# Altium schematic sheet Sheet1.SchDoc
size 431 x 228 mm; SheetNumber: 1; SheetTotal: 1
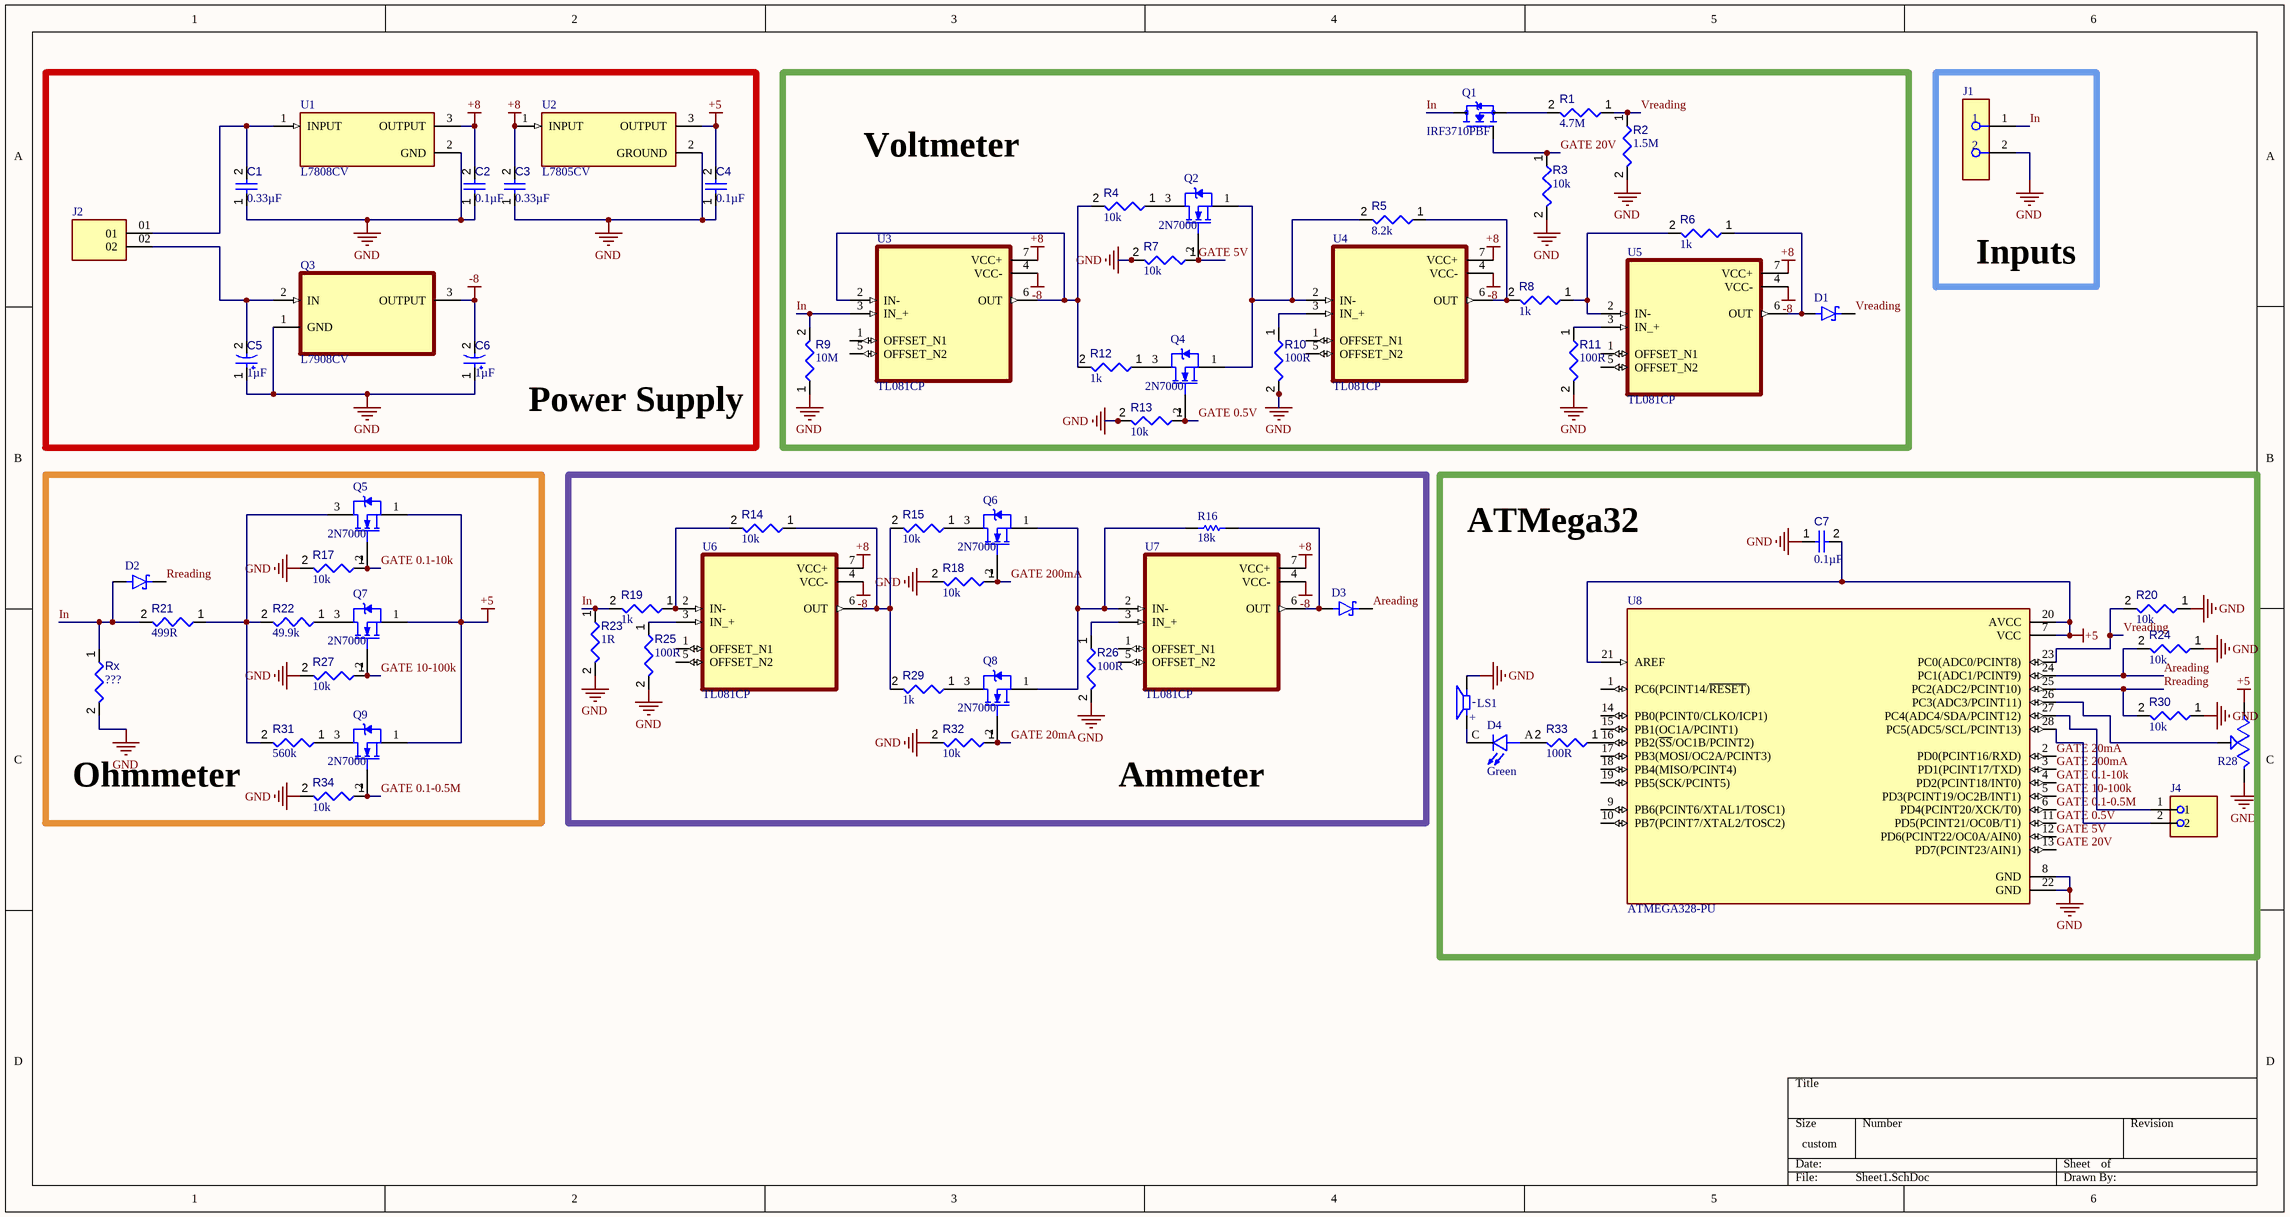
[diagram p0: Sheet1.SchDoc]

## Parts
C1  value 0.33µF  [CAPC2013X135X45NL10T25]  (hidden comment: Capacitor 1 uF +/- 10% 50 V 0805)
C2  value 0.1µF  [CAPC2013X135X45NL10T25]  (hidden comment: Capacitor 1 uF +/- 10% 50 V 0805)
C3  value 0.33µF  [CAPC2013X135X45NL10T25]  (hidden comment: Capacitor 1 uF +/- 10% 50 V 0805)
C4  value 0.1µF  [CAPC2013X135X45NL10T25]  (hidden comment: Capacitor 1 uF +/- 10% 50 V 0805)
C5  value 1µF  [CAPPR65-350-1150X800X1250]  (hidden comment: ECA-2AM470)
C6  value 1µF  [CAPPR65-350-1150X800X1250]  (hidden comment: ECA-2AM470)
C7  value 0.1µF  [CAPC2013X135X45NL10T25]  (hidden comment: Capacitor 1 uF +/- 10% 50 V 0805)
D1  1N4733A  [DIOAD1036W78L463D272]  (value not drawn)
D2  1N4733A  [DIOAD1036W78L463D272]  (value not drawn)
D3  1N4733A  [DIOAD1036W78L463D272]  (value not drawn)
D4  Green  [LEDRD254W50D500H1060]
J1  CMP-73906-000010-1_1  [FP-2269-2-MFG]  (value not drawn)
J2  SSW-102-01-X-S  [SAMTEC_SSW-102-01-X-S]  (value not drawn)
J4  1713723  [PHOENIX_1713723]  (value not drawn)
LS1  PKM17EPP-2002-B0  [SPKR_PKM17EPP-2002-B0]  (value not drawn)
Q1  IRF3710PBF  [TO254P1016X419X2057-3]
Q2  2N7000  [ONSC-TO-92-3-29-11_AM_BL]
Q3  L7908CV  [TO254P450X1020X1935-3P]
Q4  2N7000  [ONSC-TO-92-3-29-11_AM_BL]
Q5  2N7000  [ONSC-TO-92-3-29-11_AM_BL]
Q6  2N7000  [ONSC-TO-92-3-29-11_AM_BL]
Q7  2N7000  [ONSC-TO-92-3-29-11_AM_BL]
Q8  2N7000  [ONSC-TO-92-3-29-11_AM_BL]
Q9  2N7000  [ONSC-TO-92-3-29-11_AM_BL]
R1  value 4.7M  [RESC0805(2012)_L]  (hidden comment: 1KR5J)
R2  value 1.5M  [RESC0805(2012)_L]  (hidden comment: 1KR5J)
R3  value 10k  [RESC0805(2012)_L]  (hidden comment: 1KR5J)
R4  value 10k  [RESC0805(2012)_L]  (hidden comment: 1KR5J)
R5  value 8.2k  [RESC0805(2012)_L]  (hidden comment: 1KR5J)
R6  value 1k  [RESC0805(2012)_L]  (hidden comment: 1KR5J)
R7  value 10k  [RESC0805(2012)_L]  (hidden comment: 1KR5J)
R8  value 1k  [RESC0805(2012)_L]  (hidden comment: 1KR5J)
R9  value 10M  [RESC0805(2012)_L]  (hidden comment: 1KR5J)
R10  value 100R  [RESC0805(2012)_L]  (hidden comment: 1KR5J)
R11  value 100R  [RESC0805(2012)_L]  (hidden comment: 1KR5J)
R12  value 1k  [RESC0805(2012)_L]  (hidden comment: 1KR5J)
R13  value 10k  [RESC0805(2012)_L]  (hidden comment: 1KR5J)
R14  value 10k  [RESC0805(2012)_L]  (hidden comment: 1KR5J)
R15  value 10k  [RESC0805(2012)_L]  (hidden comment: 1KR5J)
R16  value 18k  [RESC3116X70X50ML13T20]  (hidden comment: Resistor 1k +/-1% 1206 250 mW)
R17  value 10k  [RESC0805(2012)_L]  (hidden comment: 1KR5J)
R18  value 10k  [RESC0805(2012)_L]  (hidden comment: 1KR5J)
R19  value 1k  [RESC0805(2012)_L]  (hidden comment: 1KR5J)
R20  value 10k  [RESC0805(2012)_L]  (hidden comment: 1KR5J)
R21  value 499R  [RESC0805(2012)_L]  (hidden comment: 1KR5J)
R22  value 49.9k  [RESC0805(2012)_L]  (hidden comment: 1KR5J)
R23  value 1R  [RESC0805(2012)_L]  (hidden comment: 1KR5J)
R24  value 10k  [RESC0805(2012)_L]  (hidden comment: 1KR5J)
R25  value 100R  [RESC0805(2012)_L]  (hidden comment: 1KR5J)
R26  value 100R  [RESC0805(2012)_L]  (hidden comment: 1KR5J)
R27  value 10k  [RESC0805(2012)_L]  (hidden comment: 1KR5J)
R28  PTN16-A10220K1B1  [POT_PTN16-A10220K1B1]  (value not drawn)
R29  value 1k  [RESC0805(2012)_L]  (hidden comment: 1KR5J)
R30  value 10k  [RESC0805(2012)_L]  (hidden comment: 1KR5J)
R31  value 560k  [RESC0805(2012)_L]  (hidden comment: 1KR5J)
R32  value 10k  [RESC0805(2012)_L]  (hidden comment: 1KR5J)
R33  value 100R  [RESC0805(2012)_L]  (hidden comment: 1KR5J)
R34  value 10k  [RESC0805(2012)_L]  (hidden comment: 1KR5J)
Rx  value ???  [RESC0805(2012)_L]  (hidden comment: 1KR5J)
U1  L7808CV  [TO255P1020X450X1968-3B]
U2  L7805CV  [TO255P1040X460X1968-3]
U3  TL081CP  [DIP794W45P254L959H508Q8]
U4  TL081CP  [DIP794W45P254L959H508Q8]
U5  TL081CP  [DIP794W45P254L959H508Q8]
U6  TL081CP  [DIP794W45P254L959H508Q8]
U7  TL081CP  [DIP794W45P254L959H508Q8]
U8  ATMEGA328-PU  [DIP787W46P254L3467H508Q28]

## Blocks framed on the sheet
Power Supply: C1-C6 J2 Q3 U1 U2
Voltmeter: D1 Q1 Q2 Q4 R1-R13 U3-U5
Inputs: J1
Ohmmeter: D2 Q5 Q7 Q9 R17 R21 R22 R27 R31 R34 Rx
Ammeter: D3 Q6 Q8 R14-R16 R18 R19 R23 R25 R26 R29 R32 U6 U7
ATMega32: C7 D4 J4 LS1 R20 R24 R28 R30 R33 U8

## Nets
+5: C4.2 C7.2 Q5.1(S) Q7.1(S) Q9.1(S) R28.1 U2.3(OUTPUT) U8.7(VCC) U8.20(AVCC) U8.21(AREF)
+8: C2.2 C3.2 U1.3(OUTPUT) U2.1(INPUT) U3.7(VCC+) U4.7(VCC+) U5.7(VCC+) U6.7(VCC+) U7.7(VCC+)
-8: C6.2 Q3.3(OUTPUT) U3.4(VCC-) U4.4(VCC-) U5.4(VCC-) U6.4(VCC-) U7.4(VCC-)
GND: C1.1 C2.1 C3.1 C4.1 C5.1 C6.1 C7.1 J1.2 LS1.N Q3.1(GND) R2.2 R3.2 R7.2 R9.1 R10.2 R11.2 R13.2 R17.2 R18.2 R20.1 R23.2 R24.1 R25.2 R26.2 R27.2 R28.3 R30.1 R32.2 R34.2 Rx.2 U1.2(GND) U2.2(GROUND) U8.8(GND) U8.22(GND)
Areading: D3.1(K) R24.2 U8.24(PC1(ADC1/PCINT9))
GATE 0.1-0.5M: Q9.2(G) R34.1 U8.6(PD4(PCINT20/XCK/T0))
GATE 0.1-10k: Q5.2(G) R17.1 U8.4(PD2(PCINT18/INT0))
GATE 0.5V: Q4.2(G) R13.1 U8.11(PD5(PCINT21/OC0B/T1))
GATE 5V: Q2.2(G) R7.1 U8.12(PD6(PCINT22/OC0A/AIN0))
GATE 10-100k: Q7.2(G) R27.1 U8.5(PD3(PCINT19/OC2B/INT1))
GATE 20mA: Q8.2(G) R32.1 U8.2(PD0(PCINT16/RXD))
GATE 20V: Q1.1(G) R3.1 U8.13(PD7(PCINT23/AIN1))
GATE 200mA: Q6.2(G) R18.1 U8.3(PD1(PCINT17/TXD))
In: D2.2(A) J1.1 Q1.2(D) R9.2 R19.2 R21.2 R23.1 Rx.1 U3.3(IN_+)
Rreading: D2.1(K) R30.2 U8.25(PC2(ADC2/PCINT10))
Vreading: D1.1(K) R1.1 R2.1 R20.2 U8.23(PC0(ADC0/PCINT8))
NetC1_2: C1.2 J2.01 U1.1(INPUT)
NetC5_2: C5.2 J2.02 Q3.2(IN)
NetD1_2: D1.2(A) R6.1 U5.6(OUT)
NetD3_2: D3.2(A) R16.1 U7.6(OUT)
NetD4_A: D4.A R33.2
NetD4_C: D4.C LS1.P
NetJ4_1: J4.1 U8.27(PC4(ADC4/SDA/PCINT12))
NetJ4_2: J4.2 U8.28(PC5(ADC5/SCL/PCINT13))
NetQ1_3: Q1.3(S) R1.2
NetQ2_1: Q2.1(S) Q4.1(S) R5.2 U4.2(IN-)
NetQ2_3: Q2.3(D) R4.1
NetQ4_3: Q4.3(D) R12.1
NetQ5_3: Q5.3(D) R21.1 R22.2 R31.2
NetQ6_1: Q6.1(S) Q8.1(S) R16.2 U7.2(IN-)
NetQ6_3: Q6.3(D) R15.1
NetQ7_3: Q7.3(D) R22.1
NetQ8_3: Q8.3(D) R29.1
NetQ9_3: Q9.3(D) R31.1
NetR4_2: R4.2 R12.2 U3.2(IN-) U3.6(OUT)
NetR5_1: R5.1 R8.2 U4.6(OUT)
NetR6_2: R6.2 R8.1 U5.2(IN-)
NetR10_1: R10.1 U4.3(IN_+)
NetR11_1: R11.1 U5.3(IN_+)
NetR14_1: R14.1 R15.2 R29.2 U6.6(OUT)
NetR14_2: R14.2 R19.1 U6.2(IN-)
NetR25_1: R25.1 U6.3(IN_+)
NetR26_1: R26.1 U7.3(IN_+)
NetR28_2: R28.2 U8.26(PC3(ADC3/PCINT11))
NetR33_1: R33.1 U8.16(PB2(~{SS}/OC1B/PCINT2))

Not connected (* = marked no-connect by the designer): U3 1(OFFSET_N1) 5(OFFSET_N2); U4 1(OFFSET_N1) 5(OFFSET_N2); U5 1(OFFSET_N1) 5(OFFSET_N2); U6 1(OFFSET_N1) 5(OFFSET_N2); U7 1(OFFSET_N1) 5(OFFSET_N2); U8 1(PC6(PCINT14/~{RESET})) 9(PB6(PCINT6/XTAL1/TOSC1)) 10(PB7(PCINT7/XTAL2/TOSC2)) 14(PB0(PCINT0/CLKO/ICP1)) 15(PB1(OC1A/PCINT1)) 17(PB3(MOSI/OC2A/PCINT3)) 18(PB4(MISO/PCINT4)) 19(PB5(SCK/PCINT5))

## Notes on the sheet
- (in symbol PKM17EPP-2002-B0) -; +

## Library data of the parts
C1-C4 C7 = CMP-001-00007-6: Chip Capacitor, 1 uF, +/- 10%, 50 V, 0805 (2012 Metric); Capacitor Type: Ceramic; Voltage Rating: 50V; Min Operating Temperature: -55°C; RoHS Compliant: True; Mounting Technology: SM; Case/Package: 0805; Max Operating Temperature: 125°C; Tolerance: 10%; Pins: 2
C5 C6 = CMP-001-00036-7: Aluminum Electrolytic Capacitor, 47 uF, +/- 20%, 100 V, -40 to 85 degC, 2-Pin THD, RoHS, Bulk; Manufacturer: Panasonic; Ripple Current: 180mA; Voltage Rating: 100V; Max Operating Temperature: 85°C; Pins: 2; Case/Package: Radial; Packaging: Bulk; Capacitor Type: Electrolytic; Diameter: 8mm; RoHS Compliant: True; Package Reference: CAPPR65-350-1150X800X1250; Min Operating Temperature: -40°C; Mounting Technology: TH; Ripple Current (AC): 180mA; Datasheet Version: Mar-16; Lead Pitch: 3.5mm; Package Quantity: 200; Datasheet URL: http://industrial.panasonic.com/cdbs/www-data/pdf/RDF0000/ABA0000C1047.pdf; Package Description: 2-Pin Radial Lead, Dia 8 mm, Height 12.5 mm; Tolerance: 20%; Manufacturer URL: http://www.panasonic.com/
D1-D3 = 1N4733A: Zener Diode 5.1 V 1 W Â±5% Through Hole DO-41; MF: onsemi; SnapEDA_Link: https://www.snapeda.com/parts/1N4733A/Onsemi/view-part/?ref=snap; Package: DO-41 ON Semiconductor; Value: *; MP: 1N4733A; Check_prices: https://www.snapeda.com/parts/1N4733A/Onsemi/view-part/?ref=eda
D4 = L-53GD: LED 5mm Green 568nm 20mcd/10mA 60Â°; MF: Kingbright; Value: *; Package: CDIP-28; Check_prices: https://www.snapeda.com/parts/L-53GD/Kingbright/view-part/?ref=eda; MP: L-53GD; Price: None; SnapEDA_Link: https://www.snapeda.com/parts/L-53GD/Kingbright/view-part/?ref=snap; Availability: Unavailable
J1 = CMP-002-00255-1: CONN DBL BANANA JACK TURRET; Gender: Female; Max Current Rating: 15A; Body Material: PC; Number of Ports: 2; Voltage Rating (DC): 70V; Insulation: Mating End Insulated; Voltage Rating: 2.5kV; Contact Plating: Tin; Package Quantity: 5; Height: 0.375inch; Weight: 0.033lb; Width: 4inch; Insulation Material: Polycarbonate; Orientation: Straight; Housing Color: Red; Termination: Solder; RoHS Compliant: Yes; Lead Free: Lead Free; Length: 24inch; Mount: Panel; Color: Red; Contact Material: Brass; Source: Schlib2.SchLib; Housing Material: Polycarbonate; Current Rating: 15A; REACH SVHC: No SVHC; Packaging: Bulk; Design Item ID: CMP-73906-000010-1_1; Depth: 16mm; Number Of Contacts: 2
J2 = SSW-102-01-X-S: 2 Position Receptacle Connector Through Hole; MP: SSW-102-01-G-S; MF: Samtec; Purchase-URL: https://pricing.snapeda.com/search/part/SSW-102-01-G-S/?ref=eda; Price: None; SnapEDA_Link: https://www.snapeda.com/parts/SSW-102-01-G-S/Samtec/view-part/4872079/?ref=snap; Check_prices: https://www.snapeda.com/parts/SSW-102-01-G-S/Samtec/view-part/4872079/?ref=eda; Package: None; Availability: Good; Value: *
J4 = 1713723: MF: {'manufacturer': u'Phoenix Contact'}; Package: None; Price: None; Value: *; MP: 1713723; Availability: Unavailable
LS1 = PKM17EPP-2002-B0: Buzzers Transducer, Externally Driven Piezo 3V 2kHz 70dB @ 3V, 10cm Through Hole PC Pins; Package: None; Price: None; Value: *; MP: PKM17EPP-2002-B0; Availability: Unavailable
Q1 = IRF3710PBF: MOSFET, Power,N-Ch,VDSS 100V,RDS(ON) 18 Milliohms,ID 7.3A,SO-8,PD 2.5W,VGS+/-20V | Infineon IRF3710PBF; MF: Infineon Technologies; SnapEDA_Link: https://www.snapeda.com/parts/IRF3710PBF/Infineon+Technologies/view-part/?ref=snap; Package: TO-220-3 Infineon; Value: *; MP: IRF3710PBF; Check_prices: https://www.snapeda.com/parts/IRF3710PBF/Infineon+Technologies/view-part/?ref=eda
Q2 Q4-Q9 = CMP-013-00020-4: Small Signal MOSFET, 200 mA, 60 V, N-Channel, 3-Pin TO-92, Bulk Box; Manufacturer: Fairchild Semiconductor; Input Capacitance: 50pF; Power: 400mW; Rds On Max: 5Ohm; Nominal Dual Supply Voltage: 60V; Elements: 1; Package Version: Rev. AM; Nominal Vgs: 2.1V; RoHS Compliant: True; Mounting Technology: TH; Max Operating Temperature: 150°C; Package Quantity: 2000; Package Reference: TO-92-3-29-11_AM_BL; Datasheet Version: Rev. 8, 04/2011; Package Description: 3-Pin Transistor Outline, Body 4.825 x 3.685 mm, Pitch 1.27 mm; Packaging: Bulk; Min Operating Temperature: -55°C; Case/Package: TO-92; Datasheet URL: http://www.onsemi.com/pub_link/Collateral/2N7000-D.PDF; Pins: 3
Q3 = L7908CV: Linear Voltage Regulator IC Negative Fixed 1 Output  1.5A TO-220; MF: STMicroelectronics; SnapEDA_Link: https://www.snapeda.com/parts/L7908CV/STMicroelectronics/view-part/?ref=snap; Package: TO-220-3 STMicroelectronics; Value: *; MP: L7908CV; Check_prices: https://www.snapeda.com/parts/L7908CV/STMicroelectronics/view-part/?ref=eda
R1-R15 R17-R27 R29-R34 Rx = CMP-009-00076-2: 1K 0.125W 5% 0805 (2012 Metric)  SMD; Power: 125mW; Pins: 2; Mounting Technology: SMT; Tolerance: 5%; Case/Package: 0805
R16 = CMP-009-00011-5: Chip Resistor, 1 KOhm, +/- 1%, 0.25 W, -55 to 155 degC, 1206 (3216 Metric); Voltage Rating: 200V; Power: 250mW; Max Operating Temperature: 155°C; Mounting Technology: SM; Tolerance: 1%; Case/Package: 1206; RoHS Compliant: True; Min Operating Temperature: -55°C; Pins: 2
R28 = PTN16-A10220K1B1: MF: {'manufacturer': u'CUI Devices'}; Package: None; Price: None; Value: *; MP: PTN16-A10220K1B1; Availability: Unavailable
U1 = L7808CV: Linear Voltage Regulator IC Positive Fixed 1 Output 1.5A TO-220; MF: STMicroelectronics; SnapEDA_Link: https://www.snapeda.com/parts/L7808CV/STMicroelectronics/view-part/?ref=snap; Package: TO-220-3 STMicroelectronics; Value: *; MP: L7808CV; Check_prices: https://www.snapeda.com/parts/L7808CV/STMicroelectronics/view-part/?ref=eda
U2 = L7805CV: Linear Voltage Regulator IC Positive Fixed 1 Output 1.5A TO-220; MF: STMicroelectronics; SnapEDA_Link: https://www.snapeda.com/parts/L7805CV/STMicroelectronics/view-part/?ref=snap; Package: TO-220-3 ON Semiconductor; MP: L7805CV; Check_prices: https://www.snapeda.com/parts/L7805CV/STMicroelectronics/view-part/?ref=eda; Purchase-URL: https://pricing.snapeda.com/search/part/L7805CV/?ref=eda; Price: None; Value: *; Availability: In Stock
U3-U7 = TL081CP: Single, 30-V, 3-MHz, 13-V/Âµs slew rate, In to V+, JFET-input op amp; MF: Texas Instruments; Availability: In Stock; SnapEDA_Link: https://www.snapeda.com/parts/TL081CP/Texas+Instruments/view-part/?ref=snap; Price: None; Check_prices: https://www.snapeda.com/parts/TL081CP/Texas+Instruments/view-part/?ref=eda; Package: PDIP-8 Texas; MP: TL081CP; Value: *; Purchase-URL: https://pricing.snapeda.com/search/part/TL081CP/?ref=eda
U8 = ATMEGA328-PU: AVR AVRÂ® ATmega Microcontroller IC 8-Bit 20MHz 32KB (16K x 16) FLASH 28-PDIP; MF: Microchip; Availability: In Stock; MP: ATMEGA328-PU; SnapEDA_Link: https://www.snapeda.com/parts/ATMEGA328-PU/Microchip/view-part/?ref=snap; Value: *; Price: None; Purchase-URL: https://pricing.snapeda.com/search/part/ATMEGA328-PU/?ref=eda; Check_prices: https://www.snapeda.com/parts/ATMEGA328-PU/Microchip/view-part/?ref=eda; Package: DIP-28 Microchip Technology